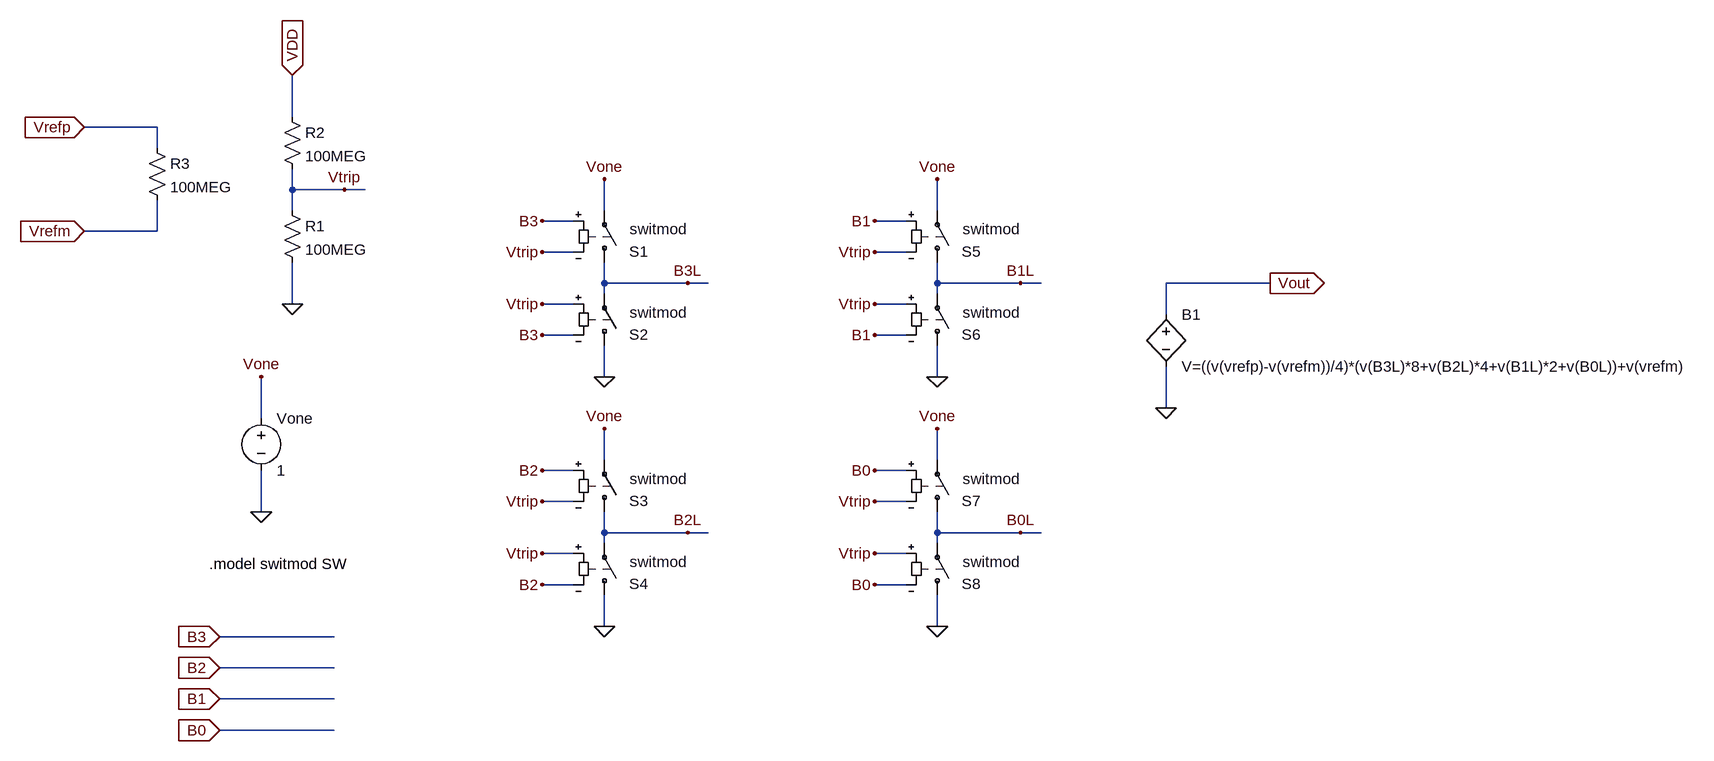
[diagram p0: schematic ideal_2_bit_dac.asc]
ideal_2_bit_dac.asc, the LTspice schematic file:
Version 4
SHEET 1 3096 1316
WIRE 528 -192 528 -256
WIRE 320 -176 208 -176
WIRE 320 -144 320 -176
WIRE 528 -80 528 -112
WIRE 608 -80 528 -80
WIRE 640 -80 608 -80
WIRE 528 -48 528 -80
WIRE 1008 -48 1008 -96
WIRE 1520 -48 1520 -96
WIRE 960 -32 912 -32
WIRE 1472 -32 1424 -32
WIRE 320 -16 320 -64
WIRE 320 -16 208 -16
WIRE 960 16 912 16
WIRE 1472 16 1424 16
WIRE 1008 64 1008 32
WIRE 1136 64 1008 64
WIRE 1168 64 1136 64
WIRE 1520 64 1520 32
WIRE 1648 64 1520 64
WIRE 1680 64 1648 64
WIRE 2032 64 1872 64
WIRE 1008 80 1008 64
WIRE 1520 80 1520 64
WIRE 528 96 528 32
WIRE 960 96 912 96
WIRE 1472 96 1424 96
WIRE 1872 112 1872 64
WIRE 960 144 912 144
WIRE 1472 144 1424 144
WIRE 1008 208 1008 160
WIRE 1520 208 1520 160
WIRE 1872 256 1872 192
WIRE 480 272 480 208
WIRE 1008 336 1008 288
WIRE 1520 336 1520 288
WIRE 960 352 912 352
WIRE 1472 352 1424 352
WIRE 960 400 912 400
WIRE 1472 400 1424 400
WIRE 480 416 480 352
WIRE 1008 448 1008 416
WIRE 1136 448 1008 448
WIRE 1168 448 1136 448
WIRE 1520 448 1520 416
WIRE 1648 448 1520 448
WIRE 1680 448 1648 448
WIRE 1008 464 1008 448
WIRE 1520 464 1520 448
WIRE 960 480 912 480
WIRE 1472 480 1424 480
WIRE 960 528 912 528
WIRE 1472 528 1424 528
WIRE 1008 592 1008 544
WIRE 1520 592 1520 544
WIRE 592 608 416 608
WIRE 592 656 416 656
WIRE 592 704 416 704
WIRE 592 752 416 752
FLAG 608 -80 Vtrip
FLAG 528 -256 VDD
IOPIN 528 -256 In
FLAG 912 -32 B3
FLAG 912 16 Vtrip
FLAG 912 96 Vtrip
FLAG 912 144 B3
FLAG 1136 64 B3L
FLAG 1008 208 0
FLAG 912 352 B2
FLAG 912 400 Vtrip
FLAG 912 480 Vtrip
FLAG 912 528 B2
FLAG 1136 448 B2L
FLAG 1008 592 0
FLAG 1872 256 0
FLAG 2032 64 Vout
IOPIN 2032 64 Out
FLAG 208 -176 Vrefp
IOPIN 208 -176 In
FLAG 208 -16 Vrefm
IOPIN 208 -16 In
FLAG 416 704 B1
IOPIN 416 704 In
FLAG 416 752 B0
IOPIN 416 752 In
FLAG 528 96 0
FLAG 480 416 0
FLAG 480 208 Vone
FLAG 1008 -96 Vone
FLAG 1008 288 Vone
FLAG 1424 -32 B1
FLAG 1424 16 Vtrip
FLAG 1424 96 Vtrip
FLAG 1424 144 B1
FLAG 1648 64 B1L
FLAG 1520 208 0
FLAG 1424 352 B0
FLAG 1424 400 Vtrip
FLAG 1424 480 Vtrip
FLAG 1424 528 B0
FLAG 1648 448 B0L
FLAG 1520 592 0
FLAG 1520 -96 Vone
FLAG 1520 288 Vone
FLAG 416 608 B3
IOPIN 416 608 In
FLAG 416 656 B2
IOPIN 416 656 In
SYMBOL res 512 -64 R0
SYMATTR InstName R1
SYMATTR Value 100MEG
SYMBOL res 512 -208 R0
SYMATTR InstName R2
SYMATTR Value 100MEG
SYMBOL sw 1008 48 M180
WINDOW 3 24 -12 Left 0
WINDOW 38 39 67 Left 0
WINDOW 0 38 33 Left 0
SYMATTR Value ""
SYMATTR SpiceModel switmod
SYMATTR InstName S1
SYMBOL sw 1008 176 M180
WINDOW 3 24 -12 Left 0
WINDOW 38 39 67 Left 0
WINDOW 0 38 33 Left 0
SYMATTR Value ""
SYMATTR SpiceModel switmod
SYMATTR InstName S2
SYMBOL sw 1008 432 M180
WINDOW 3 24 -12 Left 0
WINDOW 38 39 67 Left 0
WINDOW 0 38 33 Left 0
SYMATTR Value ""
SYMATTR SpiceModel switmod
SYMATTR InstName S3
SYMBOL sw 1008 560 M180
WINDOW 3 24 -12 Left 0
WINDOW 38 39 67 Left 0
WINDOW 0 38 33 Left 0
SYMATTR Value ""
SYMATTR SpiceModel switmod
SYMATTR InstName S4
SYMBOL bv 1872 96 R0
SYMATTR InstName B1
SYMATTR Value V=((v(vrefp)-v(vrefm))/4)*(v(B3L)*8+v(B2L)*4+v(B1L)*2+v(B0L))+v(vrefm)
SYMBOL res 304 -160 R0
SYMATTR InstName R3
SYMATTR Value 100MEG
SYMBOL voltage 480 256 R0
WINDOW 123 0 0 Left 0
WINDOW 39 0 0 Left 0
SYMATTR InstName Vone
SYMATTR Value 1
SYMBOL sw 1520 48 M180
WINDOW 3 24 -12 Left 0
WINDOW 38 39 67 Left 0
WINDOW 0 38 33 Left 0
SYMATTR Value ""
SYMATTR SpiceModel switmod
SYMATTR InstName S5
SYMBOL sw 1520 176 M180
WINDOW 3 24 -12 Left 0
WINDOW 38 39 67 Left 0
WINDOW 0 38 33 Left 0
SYMATTR Value ""
SYMATTR SpiceModel switmod
SYMATTR InstName S6
SYMBOL sw 1520 432 M180
WINDOW 3 24 -12 Left 0
WINDOW 38 39 67 Left 0
WINDOW 0 38 33 Left 0
SYMATTR Value ""
SYMATTR SpiceModel switmod
SYMATTR InstName S7
SYMBOL sw 1520 560 M180
WINDOW 3 24 -12 Left 0
WINDOW 38 39 67 Left 0
WINDOW 0 38 33 Left 0
SYMATTR Value ""
SYMATTR SpiceModel switmod
SYMATTR InstName S8
TEXT 400 496 Left 0 !.model switmod SW

The netlist it stands for:
* ideal_2_bit_dac.asc
R1 Vtrip 0 100MEG
R2 VDD Vtrip 100MEG
S1 B3L Vone B3 Vtrip switmod
S2 0 B3L Vtrip B3 switmod
S3 B2L Vone B2 Vtrip switmod
S4 0 B2L Vtrip B2 switmod
B1 Vout 0 V=((v(vrefp)-v(vrefm))/4)*(v(B3L)*8+v(B2L)*4+v(B1L)*2+v(B0L))+v(vrefm)
R3 Vrefp Vrefm 100MEG
Vone Vone 0 1
S5 B1L Vone B1 Vtrip switmod
S6 0 B1L Vtrip B1 switmod
S7 B0L Vone B0 Vtrip switmod
S8 0 B0L Vtrip B0 switmod
.model switmod SW
.backanno
.end